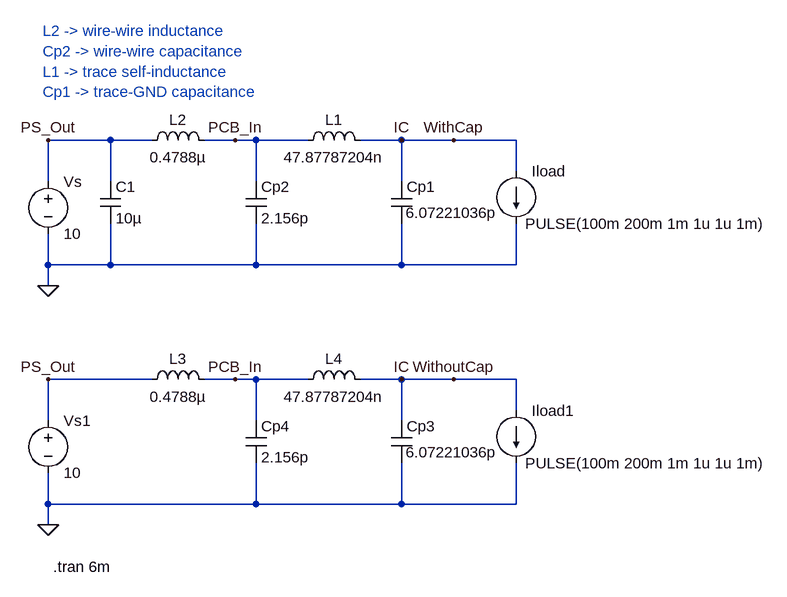
[diagram p0: schematic Lab 2 Experiment 5.asc]
Lab 2 Experiment 5.asc, the LTspice schematic file:
Version 4
SHEET 1 1288 736
WIRE 192 64 96 64
WIRE 256 64 192 64
WIRE 384 64 336 64
WIRE 416 64 384 64
WIRE 496 64 416 64
WIRE 640 64 576 64
WIRE 720 64 640 64
WIRE 816 64 720 64
WIRE 816 112 816 64
WIRE 96 128 96 64
WIRE 192 128 192 64
WIRE 416 128 416 64
WIRE 640 128 640 64
WIRE 96 256 96 208
WIRE 192 256 192 192
WIRE 192 256 96 256
WIRE 416 256 416 192
WIRE 416 256 192 256
WIRE 640 256 640 192
WIRE 640 256 416 256
WIRE 816 256 816 192
WIRE 816 256 640 256
WIRE 96 288 96 256
WIRE 256 432 96 432
WIRE 384 432 336 432
WIRE 416 432 384 432
WIRE 496 432 416 432
WIRE 640 432 576 432
WIRE 720 432 640 432
WIRE 816 432 720 432
WIRE 816 480 816 432
WIRE 96 496 96 432
WIRE 416 496 416 432
WIRE 640 496 640 432
WIRE 96 624 96 576
WIRE 416 624 416 560
WIRE 416 624 96 624
WIRE 640 624 640 560
WIRE 640 624 416 624
WIRE 816 624 816 560
WIRE 816 624 640 624
WIRE 96 656 96 624
FLAG 96 64 PS_Out
FLAG 384 64 PCB_In
FLAG 640 64 IC
FLAG 96 288 0
FLAG 96 432 PS_Out
FLAG 384 432 PCB_In
FLAG 640 432 IC
FLAG 96 656 0
FLAG 720 64 WithCap
FLAG 720 432 WithoutCap
SYMBOL voltage 96 112 R0
WINDOW 123 0 0 Left 0
WINDOW 39 0 0 Left 0
SYMATTR InstName Vs
SYMATTR Value 10
SYMBOL ind 240 80 R270
WINDOW 0 32 56 VTop 2
WINDOW 3 5 56 VBottom 2
SYMATTR InstName L2
SYMATTR Value 0.4788µ
SYMBOL ind 480 80 R270
WINDOW 0 32 56 VTop 2
WINDOW 3 5 56 VBottom 2
SYMATTR InstName L1
SYMATTR Value 47.87787204n
SYMBOL cap 624 128 R0
WINDOW 3 22 48 Left 2
SYMATTR Value 6.07221036p
SYMATTR InstName Cp1
SYMATTR SpiceLine IC=10
SYMBOL current 816 112 R0
WINDOW 3 14 81 Left 2
WINDOW 123 0 0 Left 0
WINDOW 39 0 0 Left 0
SYMATTR Value PULSE(100m 200m 1m 1u 1u 1m)
SYMATTR InstName Iload
SYMBOL cap 400 128 R0
SYMATTR InstName Cp2
SYMATTR Value 2.156p
SYMBOL cap 176 128 R0
SYMATTR InstName C1
SYMATTR Value 10µ
SYMATTR SpiceLine IC=10
SYMBOL voltage 96 480 R0
WINDOW 123 0 0 Left 0
WINDOW 39 0 0 Left 0
SYMATTR InstName Vs1
SYMATTR Value 10
SYMBOL ind 240 448 R270
WINDOW 0 32 56 VTop 2
WINDOW 3 5 56 VBottom 2
SYMATTR InstName L3
SYMATTR Value 0.4788µ
SYMBOL ind 480 448 R270
WINDOW 0 32 56 VTop 2
WINDOW 3 5 56 VBottom 2
SYMATTR InstName L4
SYMATTR Value 47.87787204n
SYMBOL cap 624 496 R0
WINDOW 3 22 48 Left 2
SYMATTR Value 6.07221036p
SYMATTR InstName Cp3
SYMATTR SpiceLine IC=10
SYMBOL current 816 480 R0
WINDOW 3 14 81 Left 2
WINDOW 123 0 0 Left 0
WINDOW 39 0 0 Left 0
SYMATTR Value PULSE(100m 200m 1m 1u 1u 1m)
SYMATTR InstName Iload1
SYMBOL cap 400 496 R0
SYMATTR InstName Cp4
SYMATTR Value 2.156p
TEXT 88 -104 Left 2 ;L2 -> wire-wire inductance\nCp2 -> wire-wire capacitance\nL1 -> trace self-inductance\nCp1 -> trace-GND capacitance
TEXT 104 720 Left 2 !.tran 6m

The netlist it stands for:
* Lab 2 Experiment 5.asc
Vs PS_Out 0 10
L2 PS_Out PCB_In 0.4788µ
L1 PCB_In WithoutCap 47.87787204n
Cp1 WithoutCap 0 6.07221036p IC=10
Iload WithoutCap 0 PULSE(100m 200m 1m 1u 1u 1m)
Cp2 PCB_In 0 2.156p
C1 PS_Out 0 10µ IC=10
Vs1 PS_Out 0 10
L3 PS_Out PCB_In 0.4788µ
L4 PCB_In WithoutCap 47.87787204n
Cp3 WithoutCap 0 6.07221036p IC=10
Iload1 WithoutCap 0 PULSE(100m 200m 1m 1u 1u 1m)
Cp4 PCB_In 0 2.156p
* L2 -> wire-wire inductance
* Cp2 -> wire-wire capacitance
* L1 -> trace self-inductance
* Cp1 -> trace-GND capacitance
.tran 6m
.backanno
.end